# EAGLE design Own_LiPoC1.pro_v2.0_Final_AR (EAGLE 9.6.2)
COMPANY: ADAFRUIT INDUSTRIES; DRAWN: KTOWN; REV: A; YEAR: 2019
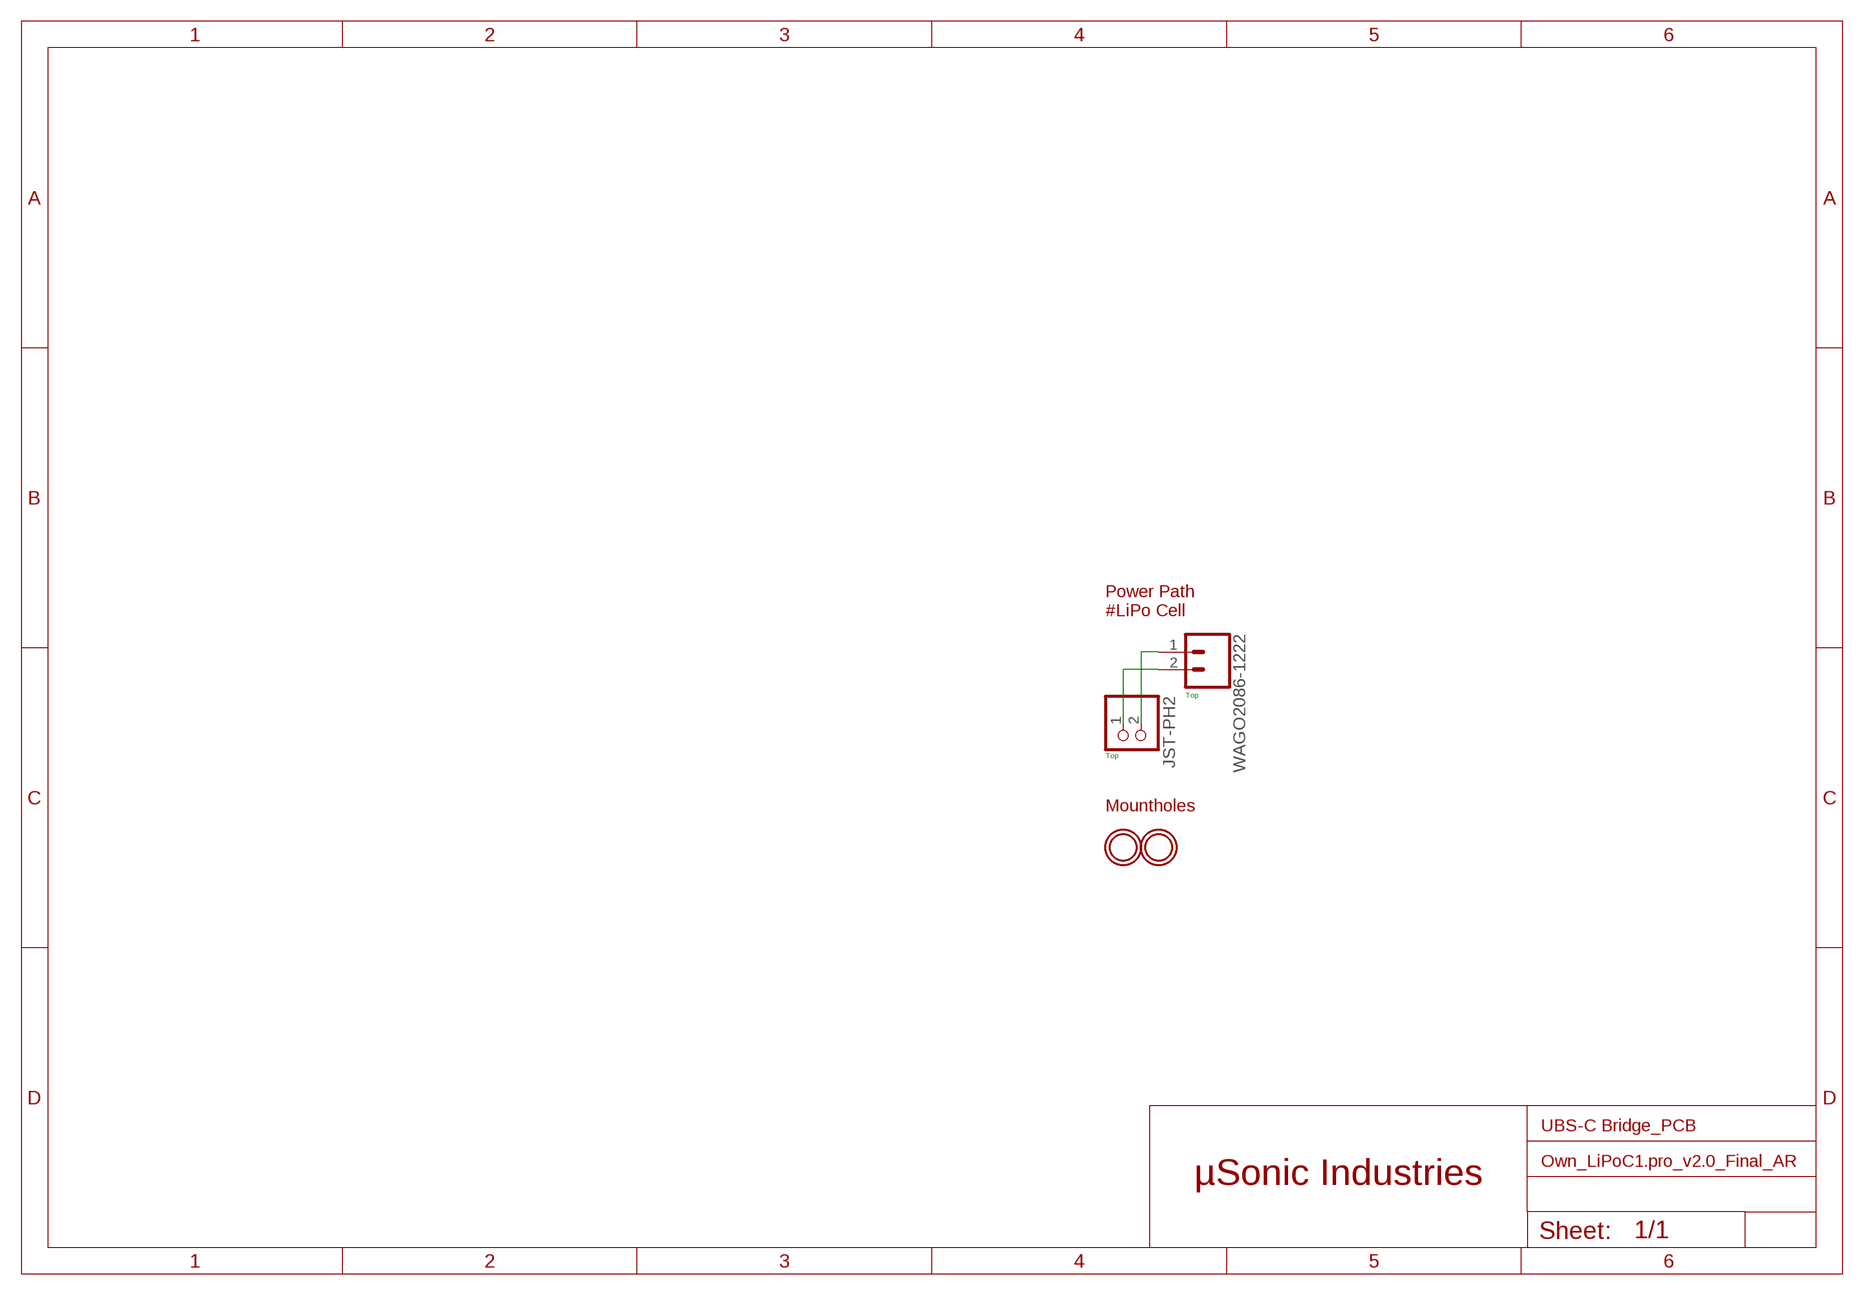
[diagram p0: schematic, sheet 1]

## Parts
JST-PH2  JST_2PINOWN  [JST-PH-2-THMOWN]
U$2  MOUNTINGHOLE2.5  [MOUNTINGHOLE_2.5_PLATED]
U$10  MOUNTINGHOLE2.5  [MOUNTINGHOLE_2.5_PLATED]
WAGO2086-1222  CONN_022086-1222_KURZ  [1X02_OWN_WAGO2086-1222]

## Nets
3V7: JST-PH2.1 WAGO2086-1222.2
GND: JST-PH2.2 WAGO2086-1222.1

## Notes on the sheet
- Power Path
  #LiPo Cell
- Top
- Top
- Mountholes
- UBS-C Bridge_PCB
- µSonic Industries

## Library data of the parts
JST-PH2 = adafruit2:JST_2PIN: JST 2-Pin Connectors of various flavors SMT-RA (S2B-PH-SM4) 4UConnector #17311 SMT (B2B-PH-SM4) THM-RA (S2B-PH) THM (B2B-PH)
U$2 U$10 = microbuilder:MOUNTINGHOLE: Mounting Hole For #2 screws (0.086"/2.18mm width, 0.094"/2.4mm hole) use 2.5mm; BOM: EXCLUDE
WAGO2086-1222 = SparkFun-Connectors2:CONN_02: Multi connection point. Often used as Generic Header-pin footprint for 0.1 inch spaced/style header connections On any of the 0.1 inch spaced packages, you can populate with these: Break Away Headers - Straight <https://www.sparkfun.com/products/116> (PRT-00116) Break Away Male Headers - Right Angle <https://www.sparkfun.com/products/553> (PRT-00553) Female Headers <https://www.sparkfun.com/products/115> (PRT-00115) Break Away Headers - Machine Pin <https://www.sparkfun.com/products/117> (PRT-00117) Break Away Female Headers - Swiss Machine Pin <https://www.sparkfun.com/products/743> (PRT-00743) For SCREWTERMINALS and SPRING TERMINALS visit here: Screw Terimnals on SparkFun.com <https://www.sparkfun.com/search/results?term=Screw+Terminals> (5mm/3.5mm/2.54mm spacing) This device is also useful as a general connection point to wire up your design to another part of your project. Our various solder wires solder well into these plated through hole pads. Hook-Up Wire - Assortment (Stranded, 22 AWG) <https://www.sparkfun.com/products/11375> (PRT-11375) Hook-Up Wire - Assortment (Solid Core, 22 AWG) <https://www.sparkfun.com/products/11367> (PRT-11367) View the entire wire category on our website here <https://www.sparkfun.com/categories/141> Special notes: Molex polarized connector foot print use with: PRT-08233 with associated crimp pins and housings. 2.54_SCREWTERM for use with PRT-10571. 3.5mm Screw Terminal footprints for PRT-08084 5mm Screw Terminal footprints for use with PRT-08432

## Net classes
0 default: width 0.2 mm

## Board
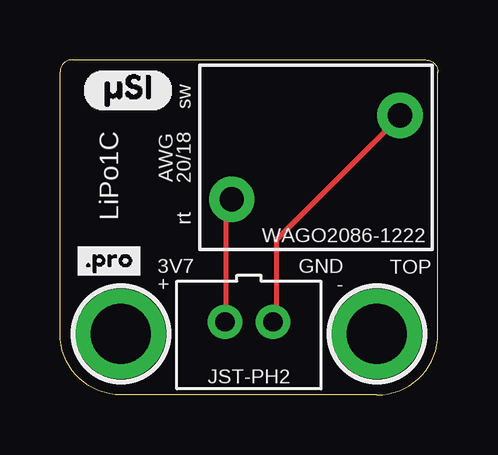
[diagram p1: board, top side]
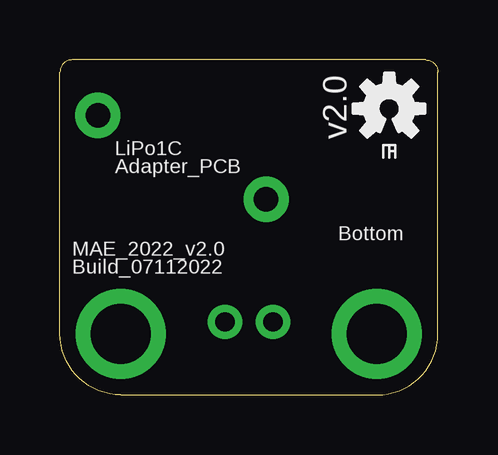
[diagram p2: board, bottom side, seen from below]

Size 15.75 x 13.97 mm. Coordinates in mm from the lower left corner, seen from the top.
Outline: 13.21,0 2.54,0 arc-90 0,2.54 0,13.46 arc-90 0.51,13.97 15.24,13.97 arc-90 15.75,13.46 15.75,2.54 arc-90 13.21,0
Copper layers (1*16): Top 0.035mm / dielectric 1.5mm / Bottom 0.035mm
Design rules "aisler_2_layer_complex": minimum track width 0.125mm, minimum drill 0.2mm, track to track 0.125mm, track to pad 0.125mm, pad to pad 0.125mm, via to via 0.125mm, smd to smd 0.125mm, copper to edge 0.3mm, drill to drill 0.25mm, minimum pad ring 0.2mm, minimum via ring 0.2mm, stop-mask expansion 0mil, vias tented up to drill 0mil, thermal gap 10mil

### Footprints (pad centres in the part's own frame; a part is rotated, then mirrored left to right if it is on the bottom)
JST-PH-2-THMOWN = drill 0.8 pad 1.422: 1 1,0; 2 -1,0
MOUNTINGHOLE_2.5_PLATED = drill 2.5 pad 3.2: P$1 0,0
1X02_OWN_WAGO2086-1222 = drill 1.016 pad 1.88: 1 3.5,1.75; 2 -3.51,-1.75

### Placement (x,y rotation side)
JST-PH2  7.87,3.05 180 top
U$1  [#SI0]  0.89,12.7 0 top
U$2  13.21,2.54 180 top
U$4  [OSHW-LOGO-S]  2.03,11.94 0 bottom
U$5  [#PRO0]  0.38,5.59 0 top
U$10  2.54,2.54 0 top
WAGO2086-1222  10.67,9.91 0 top

### Tracks (layer width: path | path; a pad name or v marks a point on that pad's centre or on a via)
3V7
  Top 0.2: JST-PH2.1 6.9,3.15 6.9,7.95 7.05,8.1 WAGO2086-1222.2
GND
  Top 0.2: JST-PH2.2 9,3.15 9,6.45 14.1,11.55 WAGO2086-1222.1

### Text on the board
tPlace: sw | AWG / 20/18 | LiPo1C | rt | WAGO2086-1222 | TOP | 3V7 / + | GND / - | JST-PH2
bPlace: v2.0 | LiPo1C / Adapter_PCB | Bottom | MAE_2022_v2.0 / Build_07112022